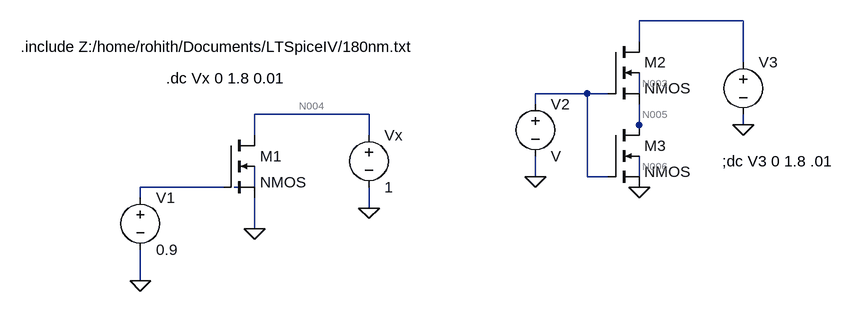
[diagram p0: schematic Draft1.asc]
Draft1.asc, the LTspice schematic file:
Version 4
SHEET 1 2916 1572
WIRE 1008 -128 848 -128
WIRE 848 -96 848 -128
WIRE 1008 -64 1008 -128
WIRE 768 -16 688 -16
WIRE 800 -16 768 -16
WIRE 848 -16 848 -48
WIRE 688 0 688 -16
WIRE 432 16 256 16
WIRE 848 32 848 0
WIRE 1008 32 1008 16
WIRE 256 48 256 16
WIRE 432 48 432 16
WIRE 848 48 848 32
WIRE 688 112 688 80
WIRE 768 112 768 -16
WIRE 800 112 768 112
WIRE 848 112 848 80
WIRE 208 128 80 128
WIRE 256 128 256 96
WIRE 256 128 224 128
WIRE 80 144 80 128
WIRE 432 160 432 128
WIRE 256 192 256 144
WIRE 80 272 80 224
FLAG 80 272 0
FLAG 256 192 0
FLAG 432 160 0
FLAG 688 112 0
FLAG 1008 32 0
FLAG 848 128 0
SYMBOL voltage 80 128 R0
WINDOW 123 0 0 Left 2
WINDOW 39 0 0 Left 2
SYMATTR InstName V1
SYMATTR Value 0.9
SYMBOL nmos4 208 48 R0
SYMATTR InstName M1
SYMATTR Value2 l=.36u w=5u
SYMBOL voltage 432 32 R0
WINDOW 123 0 0 Left 2
WINDOW 39 0 0 Left 2
SYMATTR InstName Vx
SYMATTR Value 1
SYMBOL voltage 688 -16 R0
SYMATTR InstName V2
SYMBOL nmos4 800 -96 R0
SYMATTR InstName M2
SYMATTR Value2 l=.36u w=5u
SYMBOL nmos4 800 32 R0
SYMATTR InstName M3
SYMATTR Value2 l=.36u w=5u
SYMBOL voltage 1008 -80 R0
WINDOW 123 0 0 Left 2
WINDOW 39 0 0 Left 2
SYMATTR InstName V3
SYMATTR Value ""
TEXT -104 -88 Left 2 !.include Z:/home/rohith/Documents/LTSpiceIV/180nm.txt
TEXT 120 -40 Left 2 !.dc Vx 0 1.8 0.01
TEXT 976 88 Left 2 !;dc V3 0 1.8 .01

The netlist it stands for:
* Draft1.asc
V1 N007 0 0.9
M1 N004 N007 0 N008 NMOS l=.36u w=5u
Vx N004 0 1
V2 N002 0 V
M2 N001 N002 N005 N003 NMOS l=.36u w=5u
M3 N005 N002 0 N006 NMOS l=.36u w=5u
V3 N001 0
.model NMOS NMOS
.model PMOS PMOS
.lib standard.mos
.include Z:/home/rohith/Documents/LTSpiceIV/180nm.txt
.dc Vx 0 1.8 0.01
;dc V3 0 1.8 .01
.backanno
.end

* Results of the author's LTspice run, read from the files saved beside the schematic
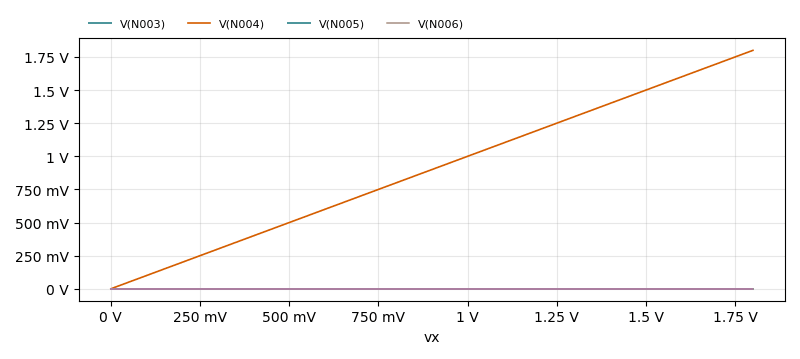
[diagram p1: DC transfer characteristic of Draft1.asc, plotted from the saved traces]
* DC transfer characteristic, 1 run:
*   V(N003): 0.04474 fV at vx=0 V, -6.831e-06 fV at vx=1.8 V, min -4.703e-05 fV, max 0.04474 fV
*   V(N004): 0 V at vx=0 V, 1.8 V at vx=1.8 V, min 0 V, max 1.8 V
*   V(N005): 0.0001472 fV at vx=0 V, -1.904e-05 fV at vx=1.8 V, min -0.0001282 fV, max 0.0001472 fV
*   V(N006): 0.04474 fV at vx=0 V, -6.831e-06 fV at vx=1.8 V, min -4.703e-05 fV, max 0.04474 fV